# EAGLE design BMS Backup rev1 (EAGLE 8.3.1)
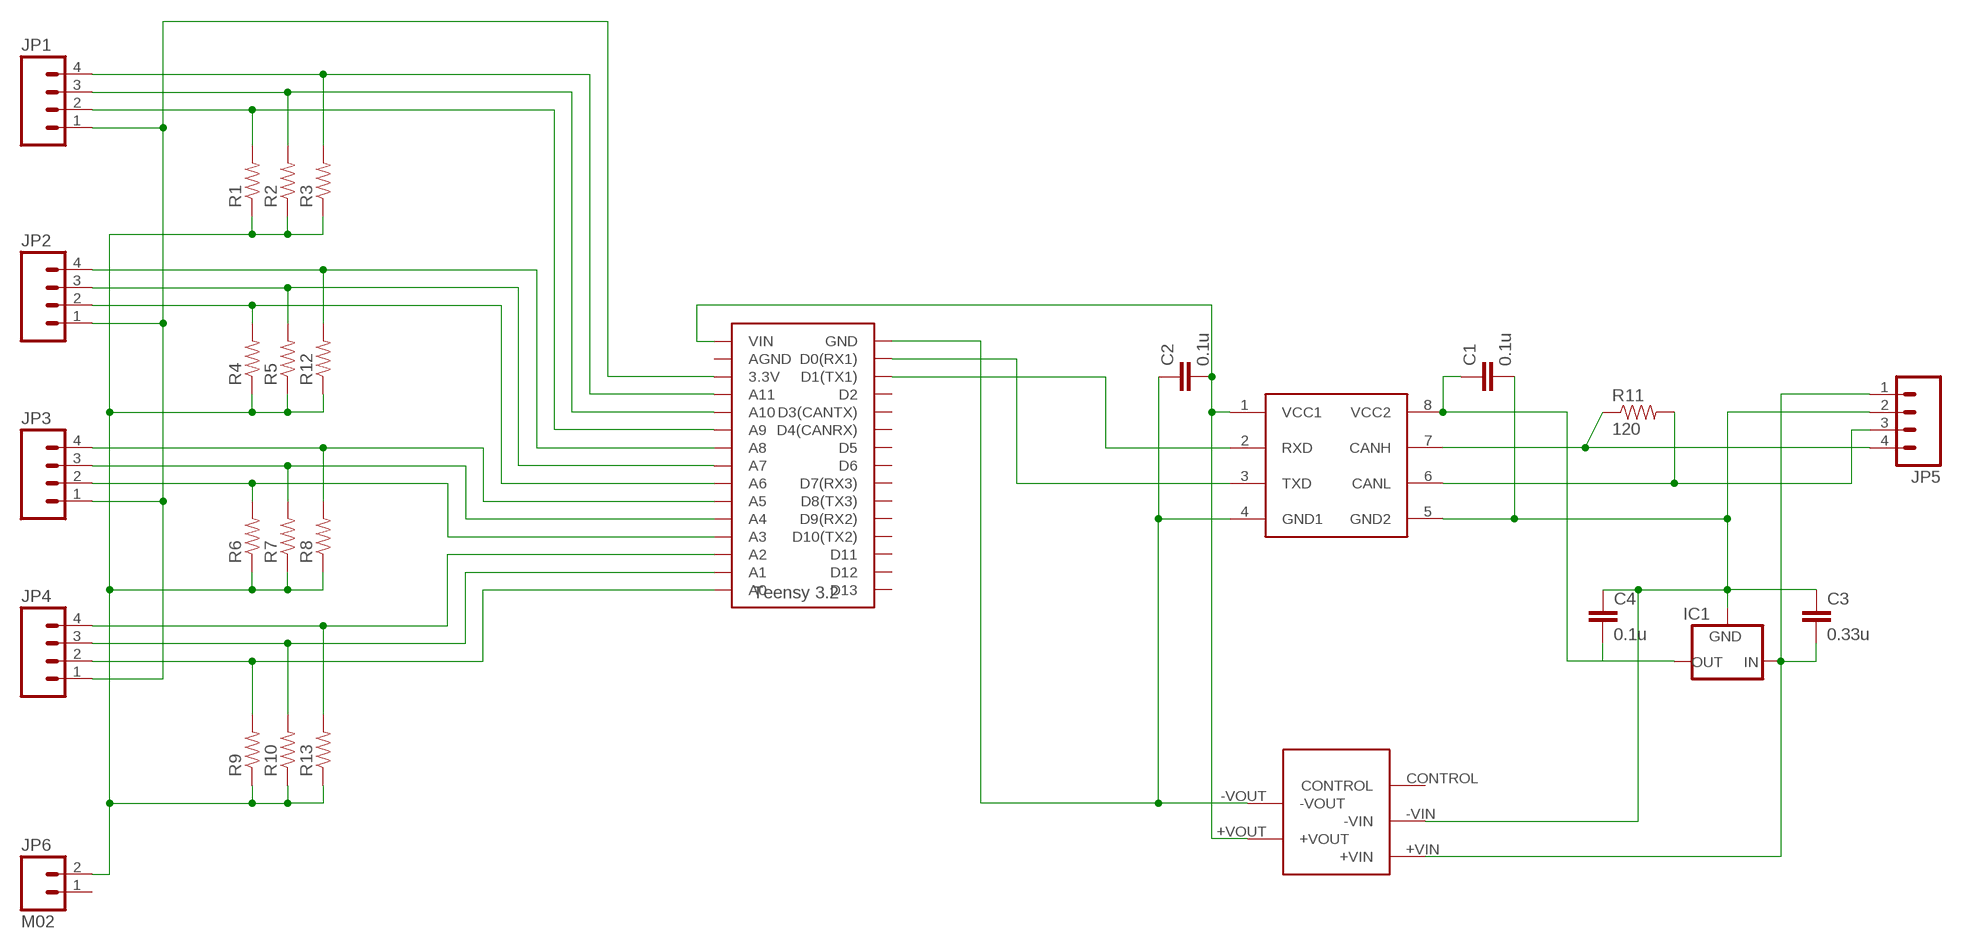
[diagram p0: schematic, sheet 1]

## Parts
C1  0.1u  CAP0805  [0805]
C2  0.1u  CAP0805  [0805]
C3  0.33u  CAP0805  [0805]
C4  0.1u  CAP0805  [0805]
IC1  5VREG_L7805SPACED  [TO-220-SPACED]
JP1  M04  [1X04]
JP2  M04  [1X04]
JP3  M04  [1X04]
JP4  M04  [1X04]
JP5  M04  [1X04]
JP6  M02  [1X02]
R1  RESISTOR0805-RES  [0805]
R2  RESISTOR0805-RES  [0805]
R3  RESISTOR0805-RES  [0805]
R4  RESISTOR0805-RES  [0805]
R5  RESISTOR0805-RES  [0805]
R6  RESISTOR0805-RES  [0805]
R7  RESISTOR0805-RES  [0805]
R8  RESISTOR0805-RES  [0805]
R9  RESISTOR0805-RES  [0805]
R10  RESISTOR0805-RES  [0805]
R11  120  RESISTOR0805-RES  [0805]
R12  RESISTOR0805-RES  [0805]
R13  RESISTOR0805-RES  [0805]
U$1  TEENSY_3.2_12ANALOG  [TEENSY_3.2_12ANALOG]
U$2  ISO1050CAN  [SOIC-08]
U$3  NCS1S1205SC-12V-5VCONVERTER  [DCDC-CONVERTER]

## Nets
3.3V: JP1.1 JP2.1 JP3.1 JP4.1 U$1.3.3V
N$1: C1.2 C3.1 C4.1 IC1.2(GND) JP5.2 U$2.5(GND2) U$3.-VIN
N$2: JP3.3 R7.2 U$1.A4
N$3: JP3.4 R8.2 U$1.A5
N$4: C3.2 IC1.1(IN) JP5.1 U$3.+VIN
N$5: C1.1 C4.2 IC1.3(OUT) U$2.8(VCC2)
N$6: JP5.4 R11.1 U$2.7(CANH)
N$7: JP5.3 R11.2 U$2.6(CANL)
N$8: U$1.D0(RX1) U$2.3(TXD)
N$9: U$1.D1(TX1) U$2.2(RXD)
N$10: C2.2 U$1.VIN U$2.1(VCC1) U$3.+VOUT
N$11: C2.1 U$1.GND U$2.4(GND1) U$3.-VOUT
N$12: JP2.4 R12.2 U$1.A8
N$13: JP4.4 R13.2 U$1.A2
THERM1: JP1.2 R1.2 U$1.A9
THERM2: JP1.3 R2.2 U$1.A10
THERM3: JP1.4 R3.2 U$1.A11
THERM4: JP2.2 R4.2 U$1.A6
THERM5: JP2.3 R5.2 U$1.A7
THERM6: JP3.2 R6.2 U$1.A3
THERM9: JP4.2 R9.2 U$1.A0
THERM10: JP4.3 R10.2 U$1.A1
TS_GND: JP6.2 R1.1 R2.1 R3.1 R4.1 R5.1 R6.1 R7.1 R8.1 R9.1 R10.1 R12.1 R13.1
Unconnected: JP6.1 U$1.AGND U$1.D2 U$1.D3(CANTX) U$1.D4(CANRX) U$1.D5 U$1.D6 U$1.D7(RX3) U$1.D8(TX3) U$1.D9(RX2) U$1.D10(TX2) U$1.D11 U$1.D12 U$1.D13 U$3.CONTROL

## Library data of the parts
C1-C4 = HyTechDevices:CAP: Capacitor Standard 0603 ceramic capacitor, and 0.1" leaded capacitor.
IC1 = HyTechDevices:5VREG_L7805: Voltage Regulator Switching 5v regulator Datasheet <http://power.murata.com/data/power/oki-78sr.pdf> Standard 7805 5V regulator. IGO (Input Ground Output). Spark Fun Electronics SKU : COM-00107 Datasheet <http://www.mouser.com/ds/2/308/MC7800-D-94905.pdf>
JP1-JP5 = HyTechDevices:M04: Standard 4-pin 0.1" header. NOTES ON THE VARIANTS LOCK and LOCK_LONGPADS... This footprint was designed to help hold the alignment of a through-hole component (i.e. 6-pin header) while soldering it into place. You may notice that each hole has been shifted either up or down by 0.005 of an inch from it's more standard position (which is a perfectly straight line). This slight alteration caused the pins (the squares in the middle) to touch the edges of the holes. Because they are alternating, it causes a "brace" to hold the component in place. 0.005 has proven to be the perfect amount of "off-center" position when using our standard breakaway headers. Although looks a little odd when you look at the bare footprint, once you have a header in there, the alteration is very hard to notice. Also,if you push a header all the way into place, it is covered up entirely on the bottom side. This idea of altering the position of holes to aid alignment will be further integrated into the Sparkfun Library for other footprints. It can help hold any component with 3 or more connection pins. Note: The Sparkfun version includes many other packages including surface mount that may be of future interest. Source: Sparkfun <https://github.com/sparkfun/SparkFun-Eagle-Libraries>
JP6 = HyTechDevices:M02: Standard 2-pin 0.1" header. NOTES ON THE VARIANTS LOCK and LOCK_LONGPADS... This footprint was designed to help hold the alignment of a through-hole component (i.e. 6-pin header) while soldering it into place. You may notice that each hole has been shifted either up or down by 0.005 of an inch from it's more standard position (which is a perfectly straight line). This slight alteration caused the pins (the squares in the middle) to touch the edges of the holes. Because they are alternating, it causes a "brace" to hold the component in place. 0.005 has proven to be the perfect amount of "off-center" position when using our standard breakaway headers. Although looks a little odd when you look at the bare footprint, once you have a header in there, the alteration is very hard to notice. Also,if you push a header all the way into place, it is covered up entirely on the bottom side. This idea of altering the position of holes to aid alignment will be further integrated into the Sparkfun Library for other footprints. It can help hold any component with 3 or more connection pins. Note: The Sparkfun version includes many other packages including surface mount that may be of future interest. Source: Sparkfun <https://github.com/sparkfun/SparkFun-Eagle-Libraries>
R1-R13 = HyTechDevices:RESISTOR: Resistor Basic schematic elements and footprints for 0603, 1206, and PTH resistors.
U$1 = HyTechDevices:TEENSY_3.2_12ANALOG
U$2 = HyTechDevices:ISO1050CAN
U$3 = HyTechDevices:NCS1S1205SC-12V-5VCONVERTER

## Board
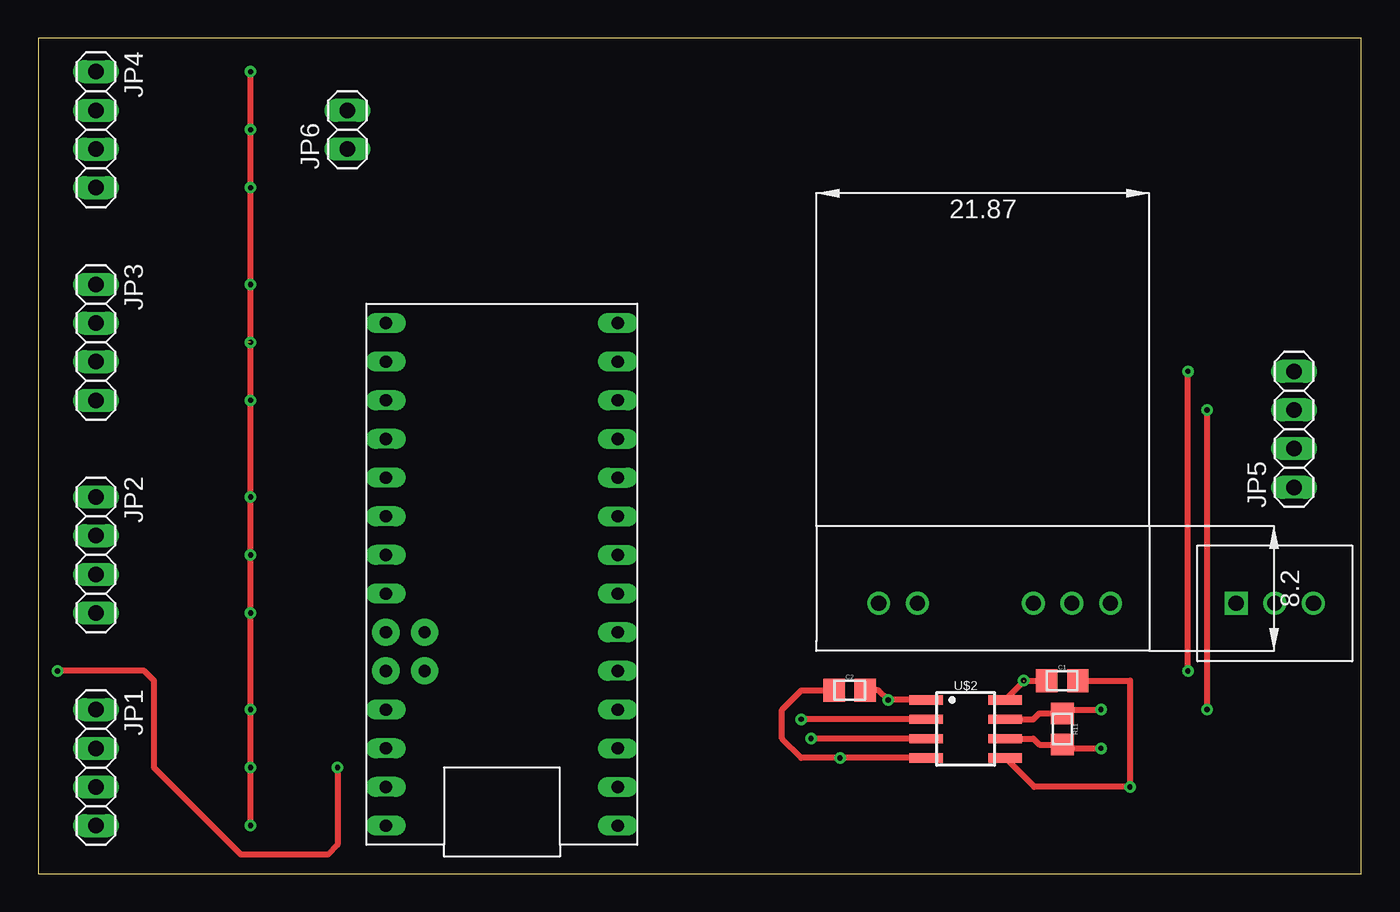
[diagram p1: board, top side]
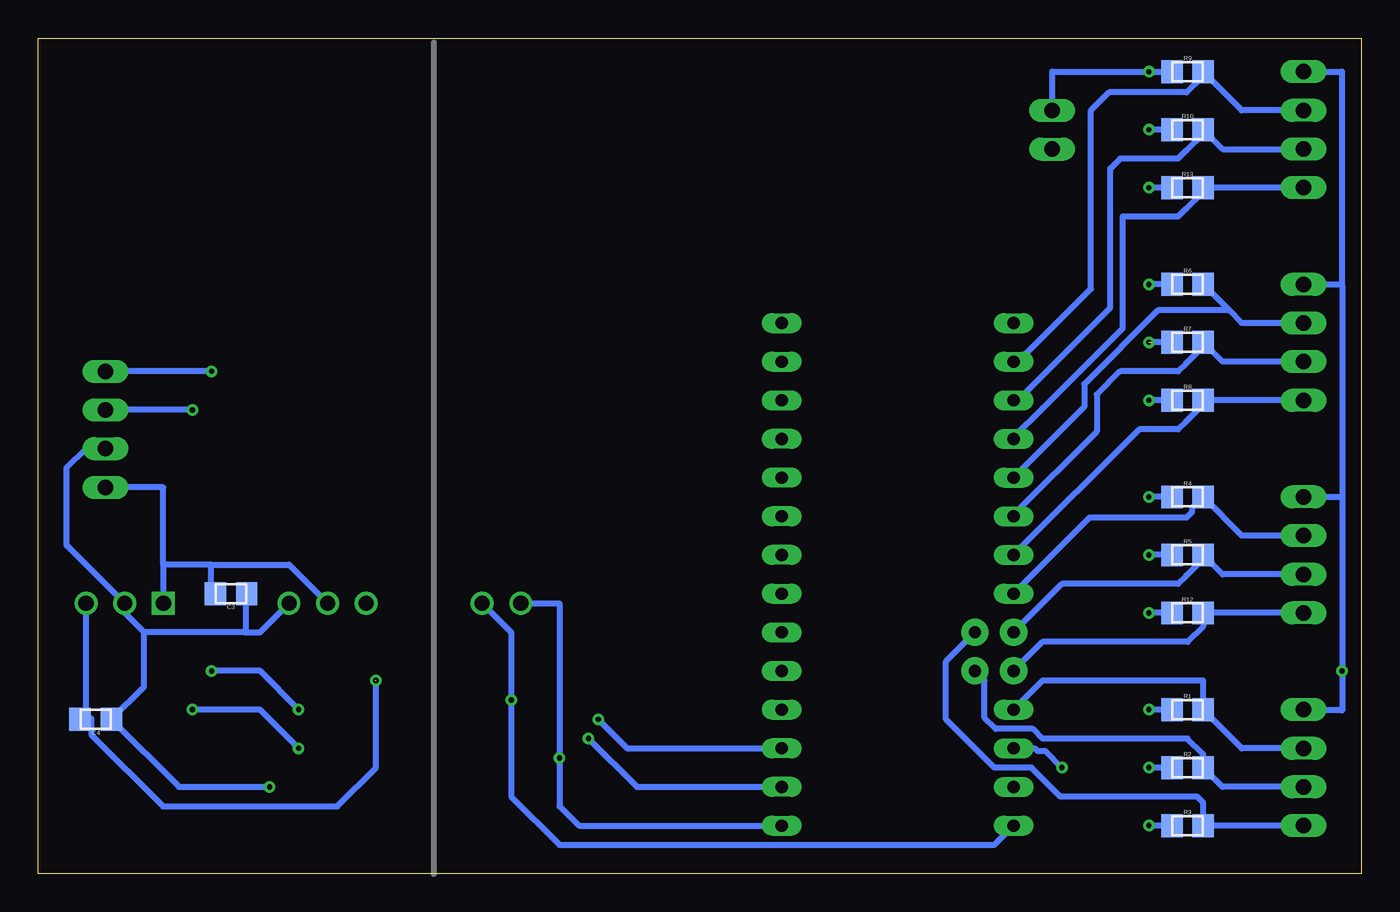
[diagram p2: board, bottom side, seen from below]

Size 86.97 x 54.91 mm. Coordinates in mm from the lower left corner, seen from the top.
Outline: 0,0 86.97,0 86.97,54.91 0,54.91 0,0
Copper layers (1*16): Top 0.035mm / dielectric 1.5mm / Bottom 0.035mm
Design rules "default *": minimum track width 6mil, minimum drill 0.35mm, track to track 16mil, track to pad 16mil, pad to pad 16mil, via to via 16mil, smd to smd 16mil, copper to edge 40mil, drill to drill 6mil, minimum pad ring 10mil, minimum via ring 8mil, stop-mask expansion 4mil, vias tented up to drill 0mil, thermal gap 10mil

### Footprints (pad centres in the part's own frame; a part is rotated, then mirrored left to right if it is on the bottom)
0805 = smd 1.4 x 1.5: 1 -1.025,0; 2 1.025,0
TO-220-SPACED = drill 1 square: 1 -2.54,0 | drill 1: 2 0,0; 3 2.54,0
1X04 = drill 1.016 long: 1 -3.81,0; 2 -1.27,0; 3 1.27,0; 4 3.81,0
1X02 = drill 1.016 long: 1 -1.27,0; 2 1.27,0
TEENSY_3.2_12ANALOG = drill 0.8 long: 3.3V 16.51,29.21; A0 16.51,3.81; A1 16.51,6.35; A2 16.51,8.89; A3 16.51,11.43; A4 16.51,13.97; A5 16.51,16.51; A6 16.51,19.05; A9 16.51,26.67; AGND 16.51,31.75; D0(RX1) 1.27,31.75; D1(TX1) 1.27,29.21; D2 1.27,26.67; D3(CANTX) 1.27,24.13; D4(CANRX) 1.27,21.59; D5 1.27,19.05; D6 1.27,16.51; D7(RX3) 1.27,13.97; D8(TX3) 1.27,11.43; D9(RX2) 1.27,8.89; D10(TX2) 1.27,6.35; D11 1.27,3.81; D12 1.27,1.27; D13 16.51,1.27; GND 1.27,34.29; VIN 16.51,34.29 | drill 0.8 pad 1.778: A7 16.51,21.59; A8 16.51,24.13; A10 13.97,24.13; A11 13.97,21.59
SOIC-08 = smd 0.6 x 2.2: 1 -1.905,-2.6; 2 -0.635,-2.6; 3 0.635,-2.6; 4 1.905,-2.6; 5 1.905,2.6; 6 0.635,2.6; 7 -0.635,2.6; 8 -1.905,2.6
DCDC-CONVERTER = drill 0.991: +VIN 5.08,5.08; +VOUT 15.24,5.08; -VIN 2.54,5.08; -VOUT 17.78,5.08; CONTROL 7.62,5.08

### Placement (x,y rotation side)
C1  67.31,12.7 0 top
C2  53.34,12.06 0 top
C3  74.3,18.41 180 bottom
C4  83.19,10.16 180 bottom
IC1  81.28,17.78 0 top
JP1  3.81,6.99 270 top
JP2  3.81,20.95 270 top
JP3  3.81,34.92 270 top
JP4  3.81,48.9 270 top
JP5  82.55,29.21 90 top
JP6  20.32,48.9 90 top
R1  11.43,10.79 0 bottom
R2  11.43,6.99 0 bottom
R3  11.43,3.17 0 bottom
R4  11.43,24.77 0 bottom
R5  11.43,20.95 0 bottom
R6  11.43,38.73 0 bottom
R7  11.43,34.92 0 bottom
R8  11.43,31.11 0 bottom
R9  11.43,52.7 0 bottom
R10  11.43,48.9 0 bottom
R11  67.31,9.53 270 top
R12  11.43,17.14 0 bottom
R13  11.43,45.09 0 bottom
U$1  39.37,37.47 180 top
U$2  60.96,9.53 270 top
U$3  73.03,22.86 180 top

### Tracks (layer width: path | path; a pad name or v marks a point on that pad's centre or on a via)
3.3V  (via drill 0.35)
  Top 0.406: v19.68,6.99 19.68,1.91 19.05,1.27 13.34,1.27 7.62,6.99 7.62,12.7 6.99,13.34 v1.27,13.34
  Bottom 0.406: JP4.1 1.27,52.7 1.27,38.66 | 1.27,24.67 v1.27,13.34 1.27,10.74 1.33,10.79 JP1.1 | 1.27,38.66 1.27,24.67 | JP2.1 1.36,24.77 1.27,24.67 | JP3.1 1.35,38.73 1.27,38.66 | U$1.3.3V 21.47,8.26 21.29,8.08 20.78,8.08 v19.68,6.99
N$1  (via drill 0.35)
  Top 0.406: U$2.5 65.47,5.71 v71.75,5.71 71.75,12.7 C1.2
  Bottom 0.406: JP5.2 83.82,27.94 85.09,26.67 85.09,21.59 IC1.2 81.28,17.14 80.01,15.88 | U$3.-VIN 72.39,15.88 73.33,15.88 | 73.33,15.88 80.01,15.88 | 80.01,15.88 80.01,12.31 C4.1 77.72,5.71 v71.75,5.71 | C3.1 73.33,18.35 73.33,15.88
N$2
  Bottom 0.406: JP3.3 9.13,33.66 R7.2 10.4,34.66 11.5,33.56 11.52,33.56 12.06,33.02 15.88,33.02 17.4,31.49 17.4,29.05 22.86,23.59 U$1.A4
N$3
  Bottom 0.406: JP3.4 R8.2 10.4,30.85 11.5,29.75 11.52,29.75 12.06,29.21 14.61,29.21 U$1.A5
N$4
  Bottom 0.406: U$3.+VIN 70.48,20.32 75.59,20.32 | 75.59,20.32 78.74,20.32 | 78.74,20.32 IC1.1 | 78.74,20.32 78.74,25.4 JP5.1 | C3.2 75.59,18.68 75.59,20.32
N$5  (via drill 0.35)  (1 unrouted)
  Top 0.406: U$2.8 64.83,12.7 C1.1
  Bottom 0.406: C4.2 83.82,10.55 | 83.82,10.55 IC1.3 | 83.82,10.55 83.47,10.2 83.47,9.16 78.76,4.45 67.31,4.45 64.77,6.99 v64.77,12.7
N$6  (via drill 0.35)
  Top 0.406: U$2.7 65.41,10.16 65.8,10.55 R11.1 67.56,10.79 v69.85,10.79 | v75.56,13.34 v75.56,33.02
  Bottom 0.406: v69.85,10.79 72.39,13.34 v75.56,13.34 | v75.56,33.02 JP5.4
N$7  (via drill 0.35)
  Top 0.406: U$2.6 65.41,8.89 65.8,8.5 R11.2 67.56,8.26 v69.85,8.26 | v76.83,10.79 v76.83,30.48
  Bottom 0.406: v69.85,8.26 72.39,10.79 v76.83,10.79 | v76.83,30.48 JP5.3
N$8  (via drill 0.35)
  Top 0.406: U$2.3 v50.8,8.89
  Bottom 0.406: v50.8,8.89 47.62,5.71 U$1.D0(RX1)
N$9  (via drill 0.35)
  Top 0.406: U$2.2 v50.16,10.16
  Bottom 0.406: v50.16,10.16 48.26,8.26 U$1.D1(TX1)
N$10  (via drill 0.35)
  Top 0.406: U$2.1 v55.88,11.43 55.24,12.06 C2.2
  Bottom 0.406: U$3.+VOUT 55.88,15.88 v55.88,11.43 55.88,5.08 52.7,1.91 24.13,1.91 U$1.VIN
N$11  (via drill 0.35)
  Top 0.406: U$2.4 v52.7,7.62 50.16,7.62 48.9,8.89 48.9,10.79 50.16,12.06 C2.1
  Bottom 0.406: U$3.-VOUT 52.7,17.78 v52.7,7.62 52.7,4.45 51.44,3.17 U$1.GND
N$12
  Bottom 0.406: JP2.4 R12.2 10.4,16.27 11.43,15.24 20.95,15.24 U$1.A8
N$13
  Bottom 0.406: JP4.4 R13.2 10.4,44.82 11.5,43.73 11.52,43.73 12.06,43.18 15.7,43.18 15.7,35.85 20.94,30.6 20.94,30.59 22.86,28.67 U$1.A2
THERM1
  Bottom 0.406: JP1.2 7.87,8.26 R1.2 10.4,12.7 20.95,12.7 U$1.A9
THERM2
  Bottom 0.406: JP1.3 9.13,5.71 R2.2 10.4,7.87 11.43,8.89 20.95,8.89 21.6,9.53 24.04,9.53 24.78,10.27 24.78,12.71 U$1.A10
THERM3
  Bottom 0.406: JP1.4 R3.2 10.4,4.69 10.79,5.08 19.78,5.08 21.68,6.98 24.12,6.98 27.3,10.16 27.3,13.97 U$1.A11
THERM4
  Bottom 0.406: JP2.2 7.87,22.23 R4.2 11.14,24.02 11.14,23.76 11.5,23.41 17.87,23.41 U$1.A6
THERM5
  Bottom 0.406: JP2.3 9.13,19.68 R5.2 10.4,20.69 11.5,19.59 11.52,19.59 12.06,19.05 19.68,19.05 U$1.A7
THERM6
  Bottom 0.406: JP3.2 7.87,36.2 8.7,37.02 | 8.7,37.02 R6.2 | 8.7,37.02 13.37,37.02 18.21,32.18 18.21,30.68 U$1.A3
THERM9
  Bottom 0.406: JP4.2 7.87,50.16 R9.2 10.4,52.44 11.5,51.34 16.6,51.34 17.78,50.16 17.78,38.44 22.57,33.66 U$1.A0
THERM10
  Bottom 0.406: JP4.3 9.13,47.62 R10.2 10.4,48.63 11.5,47.53 11.52,47.53 12.06,46.99 15.85,46.99 16.51,46.33 | 16.51,46.33 16.51,46.35 | 16.51,46.33 16.51,37.19 22.59,31.11 U$1.A1
TS_GND  (via drill 0.35)  (1 unrouted)
  Top 0.406: v13.97,3.17 v13.97,6.99 v13.97,10.79 v13.97,17.14 v13.97,20.95 v13.97,24.77 v13.97,31.11 v13.97,34.92 v13.97,38.73 v13.97,45.09 v13.97,48.9 v13.97,52.7
  Bottom 0.406: JP6.2 20.32,52.7 v13.97,52.7 R9.1 | R10.1 v13.97,48.9 | R13.1 v13.97,45.09 | R6.1 v13.97,38.73 | R7.1 13.79,34.92 | R8.1 v13.97,31.11 | R4.1 v13.97,24.77 | R5.1 v13.97,20.95 | R12.1 v13.97,17.14 | R1.1 v13.97,10.79 | R2.1 v13.97,6.99 | R3.1 v13.97,3.17

### Text on the board
tDocu: GLV | TS | TS | GLV | GLV | TS